# Altium schematic sheet pca20035_sheet1_connections.SchDoc: Thingy:91 Connections
size A3; Organization: Nordic Semiconductor; DocumentNumber: 1; SheetNumber: 1; SheetTotal: 6; CompanyName: Nordic Semiconductor; DocumentSize: A3
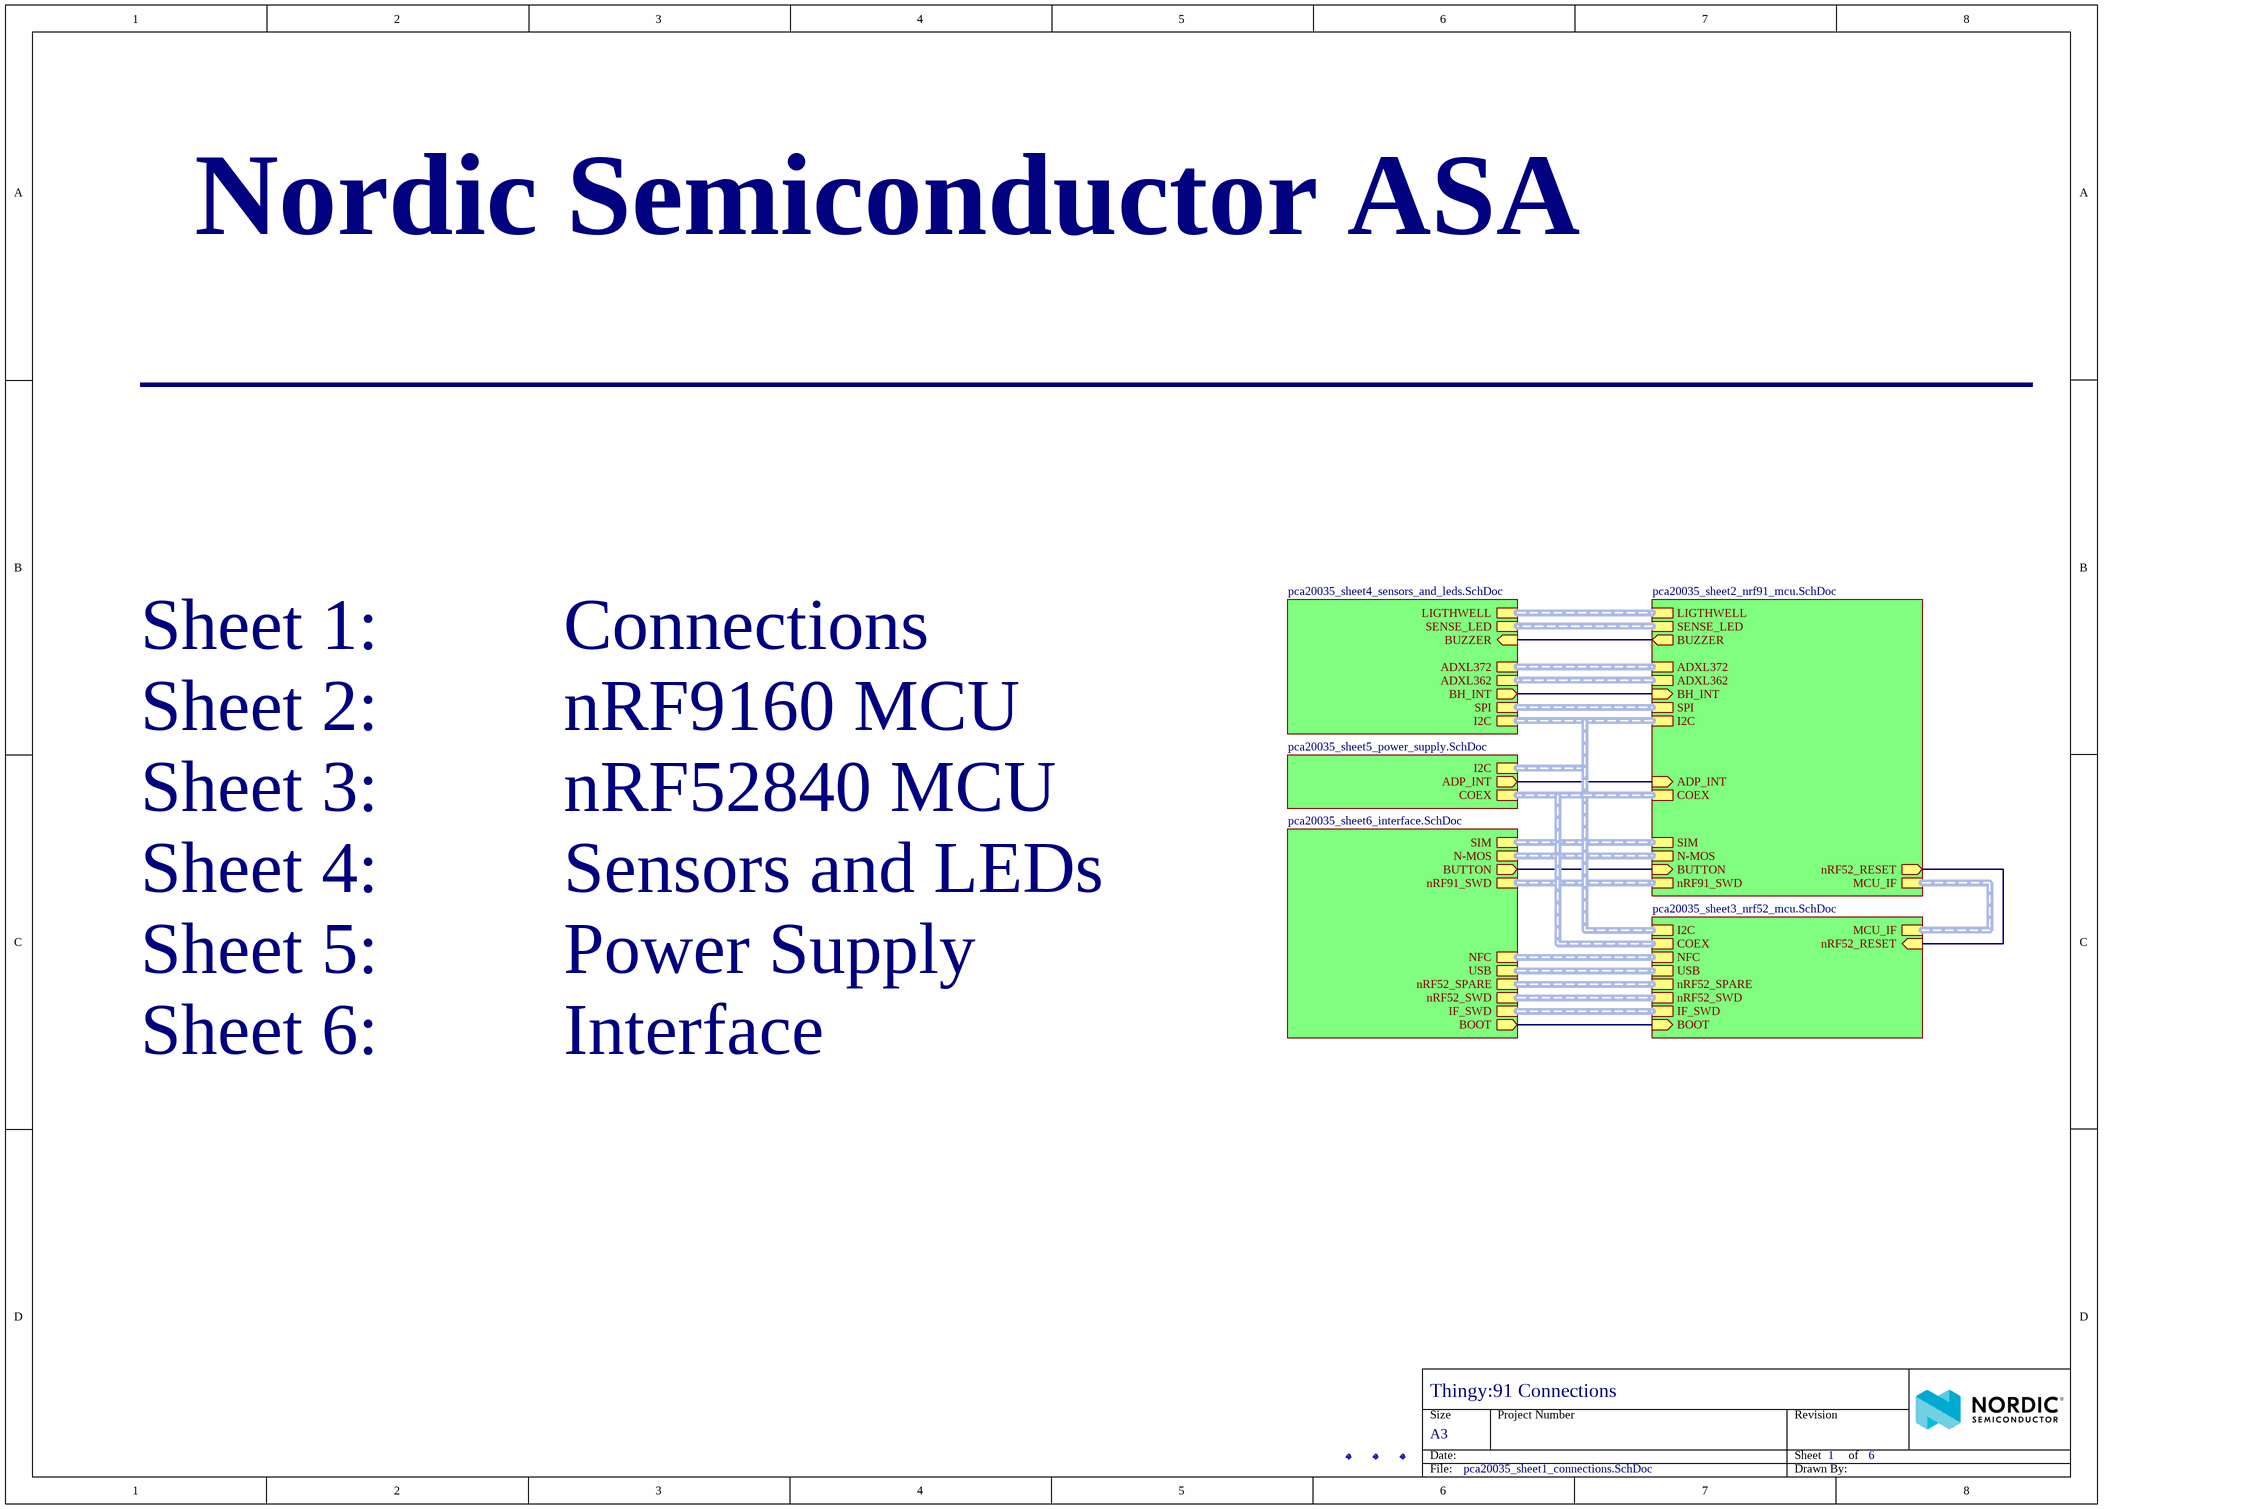
[diagram p0: pca20035_sheet1_connections.SchDoc]

## Parts
Fid1  Fiducial mark  [Fiducial_Round-Square]  (value not drawn)
Fid2  Fiducial mark  [Fiducial_Round-Square]  (value not drawn)
Fid3  Fiducial mark  [Fiducial_Round-Square]  (value not drawn)

## Sub-sheets
? = pca20035_sheet2_nrf91_mcu.SchDoc: SIM (harness SIM), nRF91_SWD (harness SWD), ADP_INT (in), COEX (harness COEX), BUZZER (out), BH_INT (in), LIGTHWELL (harness LED), MCU_IF (harness MCU_IF), I2C (harness I2C), BUTTON (in), SENSE_LED (harness LED), N-MOS (harness N-MOS), SPI (harness SPI), ADXL372 (harness ADXL), ADXL362 (harness ADXL), nRF52_RESET (out)
? = pca20035_sheet4_sensors_and_leds.SchDoc: BUZZER (in), I2C (harness I2C), BH_INT (out), LIGTHWELL (harness LED), SENSE_LED (harness LED), SPI (harness SPI), ADXL362 (harness ADXL), ADXL372 (harness ADXL)
? = pca20035_sheet3_nrf52_mcu.SchDoc: USB (harness USB), nRF52_SPARE (harness SPARE), NFC (harness NFC), COEX (harness COEX), IF_SWD (harness IF SWD), I2C (harness I2C), MCU_IF (harness MCU_IF), nRF52_SWD (harness SWD), BOOT (in), nRF52_RESET (in)
? = pca20035_sheet6_interface.SchDoc: N-MOS (harness N-MOS), NFC (harness NFC), nRF52_SPARE (harness SPARE), SIM (harness SIM), IF_SWD (harness IF SWD), nRF52_SWD (harness SWD), nRF91_SWD (harness SWD), BUTTON (out), USB (harness USB), BOOT (out)
? = pca20035_sheet5_power_supply.SchDoc: I2C (harness I2C), ADP_INT (out), COEX (harness COEX)

## Nets
(unnamed): sheet /ADP_INT, sheet /ADP_INT
(unnamed): sheet /BUZZER, sheet /BUZZER
(unnamed): sheet /BH_INT, sheet /BH_INT
(unnamed): sheet /BUTTON, sheet /BUTTON
(unnamed): sheet /nRF52_RESET, sheet /nRF52_RESET
(unnamed): sheet /BOOT, sheet /BOOT

## Notes on the sheet
- Nordic Semiconductor ASA
- ___________________________________________
- Sheet 1:          Connections
- Sheet 2:          nRF9160 MCU
- Sheet 3:          nRF52840 MCU
- Sheet 4:          Sensors and LEDs
- Sheet 5:          Power Supply
- Sheet 6:          Interface
- Size
- Date:
- A3
- Project Number
- Sheet         of
- Revision
- File:
- Drawn By:

## Library data of the parts
Fid1-Fid3 = Fid-Mark-Round-Square: Manufacturer: N.A.; Value: N.A.; Pad Count: 1; Part Number: Fid-Mark-Round-Square; Manufacturer Part Number: N.A.; LatestRevisionDate: 2017-01-30; Published: 2009-12-12; Note: N.A.; Artikkelnr Noca: N.A.; Footprint Doc: Fiducial; Part number IPS: N.A.; ComponentLink1URL: N.A.; ComponentLink1Description: Datasheet; ComponentLink2URL: N.A.; ComponentLink2Description: Supplier link; HelpURL: N.A.; Supplier 1: N.A.; Supplier Part Number 1: N.A.; Supplier 2: N.A.; Supplier Part Number 2: N.A.; Component Class: Connectors; PartId: 100500075